# Altium schematic sheet GLCD.SchDoc
size A3; Date: 20/05/2020; Engineer: Domenico Spagnuolo; DocumentNumber: 1; SheetNumber: 1; SheetTotal: 1; Section: Graphic LCD; Rev: A0
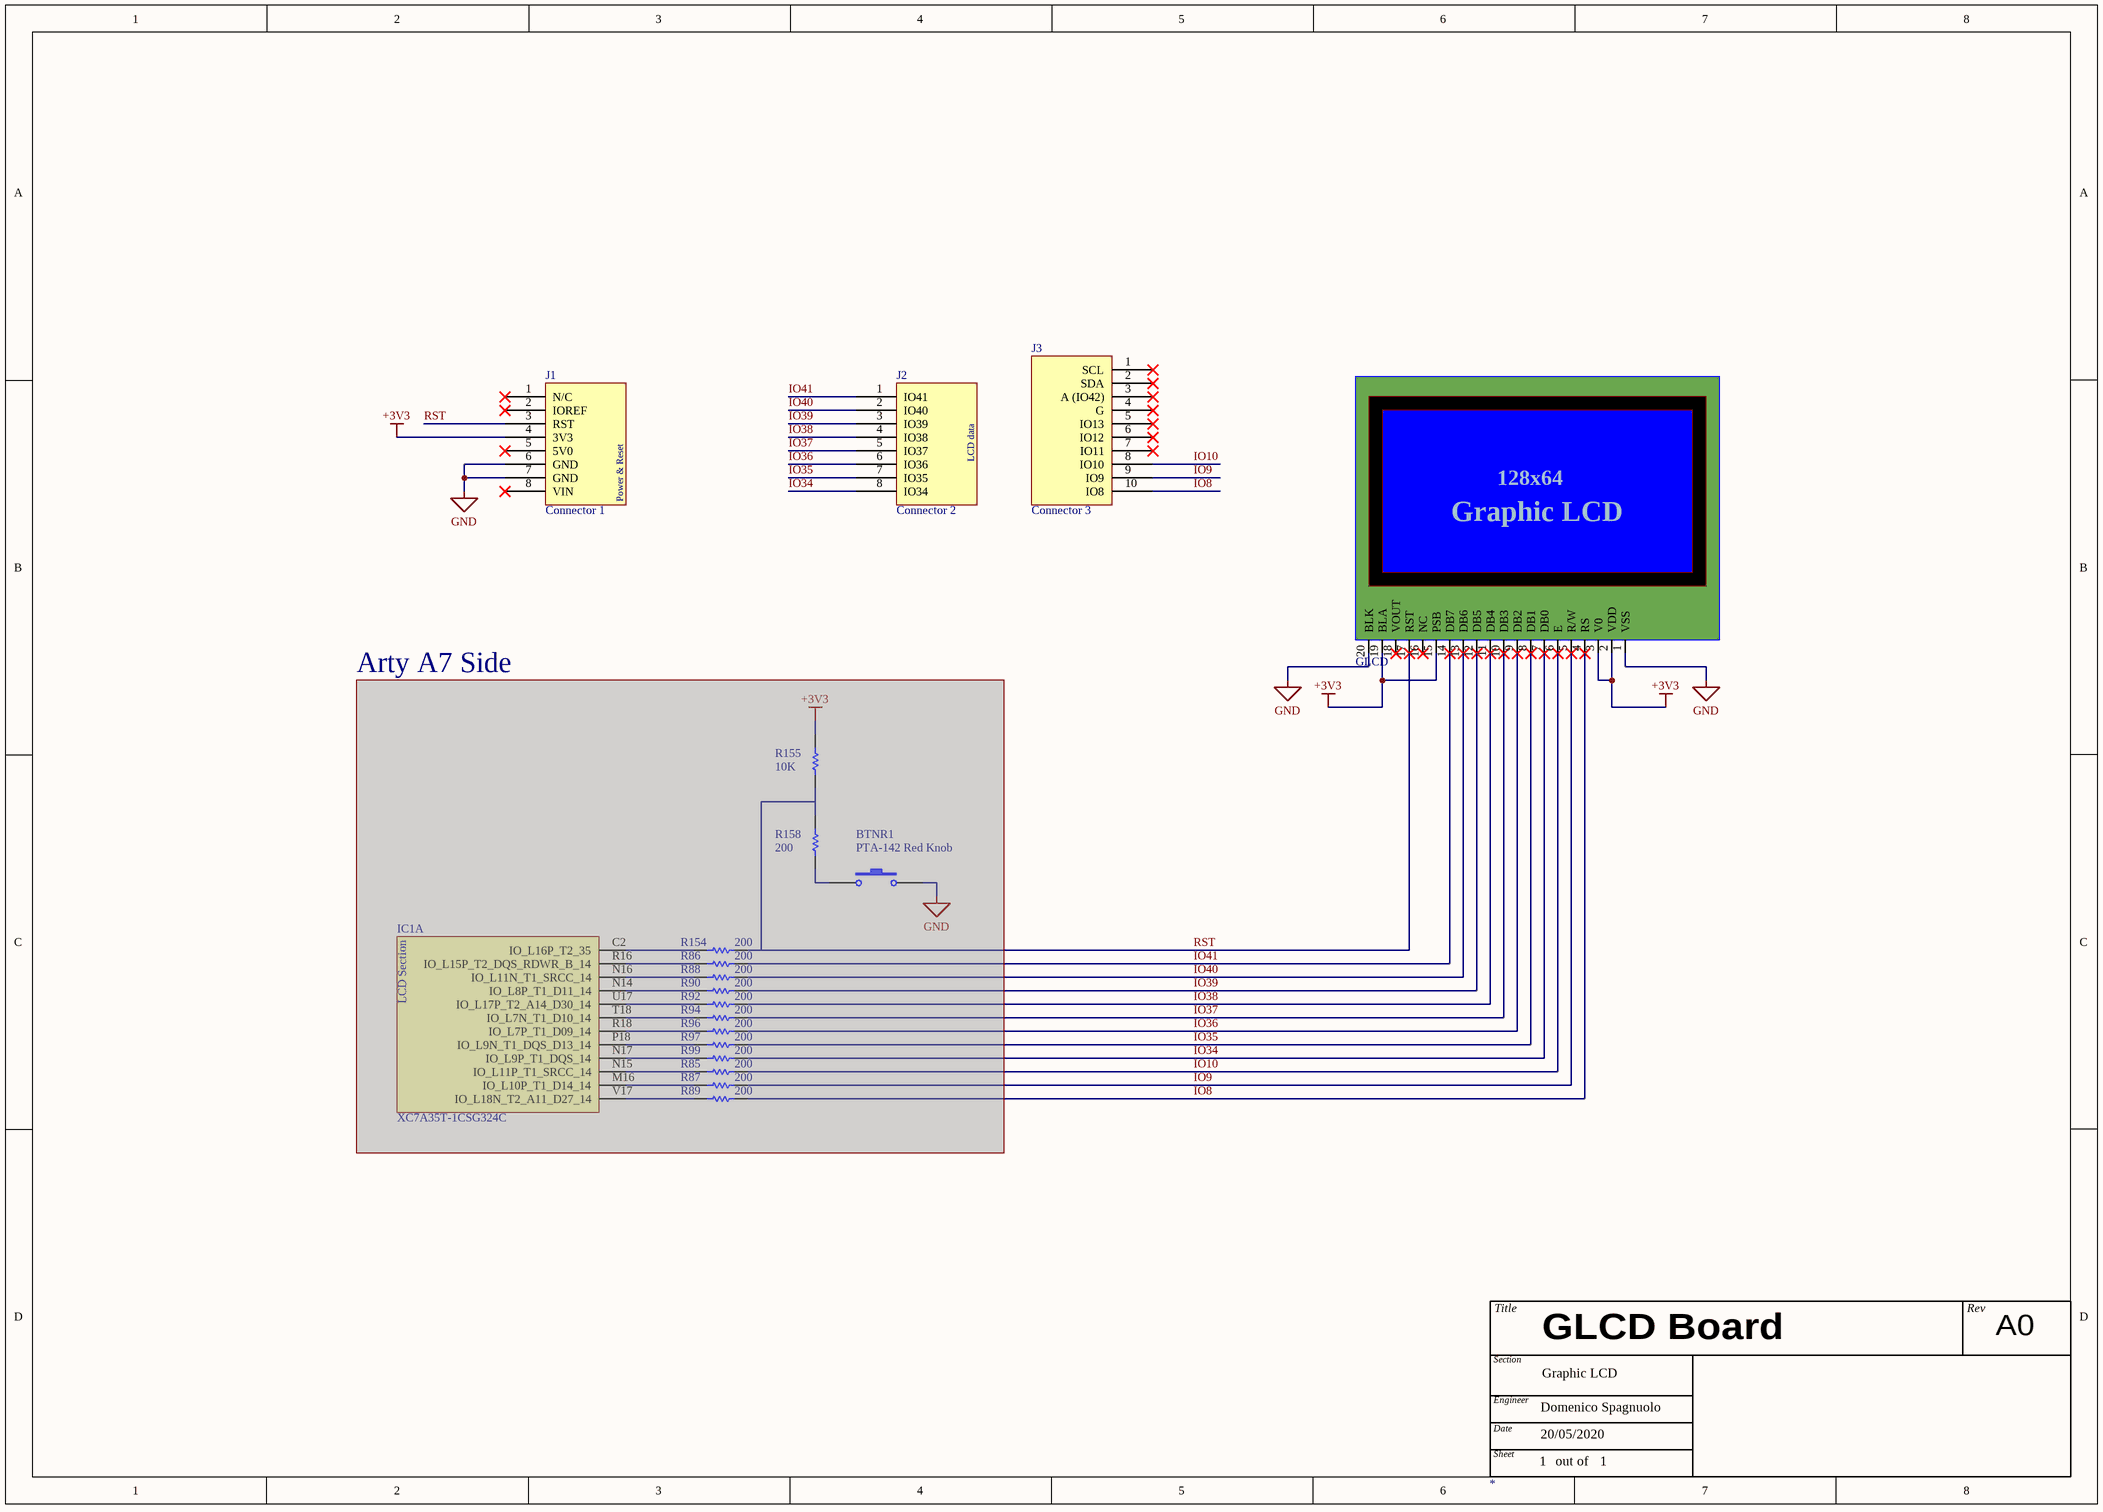
[diagram p0: GLCD.SchDoc]

## Parts
*  Title Block  (value not drawn)  (graphical)
BTNR1  PTA-142 Red Knob  [SPST-2]  (masked out: inside a compile mask, not in the netlist)
GLCD_128x64  GLCD  [GLCD]
IC1  XC7A35T-1CSG324C  (part A of 3)  (masked out: inside a compile mask, not in the netlist)
J1  Connector 1  [1x8 HEADER]
J2  Connector 2  [1x8 HEADER]
J3  Connector 3  [1x10 Header]
R85  value 200  (hidden comment: Res)  (masked out: inside a compile mask, not in the netlist)
R86  value 200  (hidden comment: Res)  (masked out: inside a compile mask, not in the netlist)
R87  value 200  (hidden comment: Res)  (masked out: inside a compile mask, not in the netlist)
R88  value 200  (hidden comment: Res)  (masked out: inside a compile mask, not in the netlist)
R89  value 200  (hidden comment: Res)  (masked out: inside a compile mask, not in the netlist)
R90  value 200  (hidden comment: Res)  (masked out: inside a compile mask, not in the netlist)
R92  value 200  (hidden comment: Res)  (masked out: inside a compile mask, not in the netlist)
R94  value 200  (hidden comment: Res)  (masked out: inside a compile mask, not in the netlist)
R96  value 200  (hidden comment: Res)  (masked out: inside a compile mask, not in the netlist)
R97  value 200  (hidden comment: Res)  (masked out: inside a compile mask, not in the netlist)
R99  value 200  (hidden comment: Res)  (masked out: inside a compile mask, not in the netlist)
R154  value 200  (hidden comment: Res)  (masked out: inside a compile mask, not in the netlist)
R155  value 10K  (hidden comment: Res)  (masked out: inside a compile mask, not in the netlist)
R158  value 200  (hidden comment: Res)  (masked out: inside a compile mask, not in the netlist)

## Nets
+3V3: GLCD_128x64.2(VDD) GLCD_128x64.3(V0) GLCD_128x64.15(PSB) GLCD_128x64.19(BLA) J1.4(3V3)
GND: GLCD_128x64.1(VSS) GLCD_128x64.20(BLK) J1.6(GND) J1.7(GND)
IO8: GLCD_128x64.4(RS) J3.10(IO8)
IO9: GLCD_128x64.5(R/W) J3.9(IO9)
IO10: GLCD_128x64.6(E) J3.8(IO10)
IO34: GLCD_128x64.7(DB0) J2.8(IO34)
IO35: GLCD_128x64.8(DB1) J2.7(IO35)
IO36: GLCD_128x64.9(DB2) J2.6(IO36)
IO37: GLCD_128x64.10(DB3) J2.5(IO37)
IO38: GLCD_128x64.11(DB4) J2.4(IO38)
IO39: GLCD_128x64.12(DB5) J2.3(IO39)
IO40: GLCD_128x64.13(DB6) J2.2(IO40)
IO41: GLCD_128x64.14(DB7) J2.1(IO41)
RST: GLCD_128x64.17(RST) J1.3(RST)

Not connected (* = marked no-connect by the designer): GLCD_128x64 16(NC)* 18(VOUT)*; J1 1(N/C)* 2(IOREF)* 5(5V0)* 8(VIN)*; J3 1(SCL)* 2(SDA)* 3(A_(IO42))* 4(G)* 5(IO13)* 6(IO12)* 7(IO11)*

## Notes on the sheet
- Arty A7 Side
- (in symbol Connector 1) Power & Reset
- (in symbol Connector 2) LCD data
- (in symbol GLCD) 128x64; Graphic LCD
- (in symbol TitleBlock) Title; Rev; GLCD Board; Section; Engineer; Date; Sheet; out of
- (in symbol XC7A35T-1CSG324C, part A) LCD Section

## Library data of the parts
* = TitleBlock
BTNR1 = SW-PB: Switch; Published: 24-Mar-1999; LatestRevisionDate: 17-Jul-2002; LatestRevisionNote: Re-released for DXP Platform.; PackageReference: SPST-2; Publisher: Altium Limited; PackageDescription: Switch; 2 Leads
GLCD_128x64 = GLCD: Graphic LCD 128x64
IC1 = XC7A35T-1CSG324C: Integrated Circuit; Manufacturer_Name: XILINX; Datasheet Link: http://www.xilinx.com/support/documentation/data_sheets/ds180_7Series_Overview.pdf; Height: 1.5mm; Manufacturer_Part_Number: XC7A35T-1CSG324C; Mouser Part Number: 217-XC7A35T-1CSG324C; Mouser Price/Stock: https://www.mouser.co.uk/ProductDetail/Xilinx/XC7A35T-1CSG324C?qs=rrS6PyfT74cxvR58nHYPWA%3D%3D
J1 = Connector 1: 1x8 Header; Manufacturer_Name: Amphenol; Manufacturer_Part_Number: 10129378-908001BLF; Datasheet Link: https://cdn.amphenol-icc.com/media/wysiwyg/files/drawing/10129378.pdf; Height: 8.58mm; Mouser Part Number: 649-1012937890801BLF; Mouser Price/Stock: https://www.mouser.com/Search/Refine.aspx?Keyword=649-1012937890801BLF
J2 = Connector 2: 1x8 Header; Manufacturer_Name: Amphenol; Manufacturer_Part_Number: 10129378-908001BLF; Datasheet Link: https://cdn.amphenol-icc.com/media/wysiwyg/files/drawing/10129378.pdf; Height: 8.58mm; Mouser Part Number: 649-1012937890801BLF; Mouser Price/Stock: https://www.mouser.com/Search/Refine.aspx?Keyword=649-1012937890801BLF
J3 = Connector 3: 1x10 Header
R85-R90 R92 R94 R96 R97 R99 R154 R155 R158 = Res: Resistor; Published: 8-Jun-2000; LatestRevisionDate: 17-Jul-2002; LatestRevisionNote: Re-released for DXP Platform.; PackageReference: AXIAL-0.3; Publisher: Altium Limited; PackageDescription: Axial Device, Thru-Hole; 2 Leads; 0.3 in Pin Spacing